# Altium schematic sheet SCH-2.SchDoc
size A4; Date: 05.05.2020; Organization: Günsel Model 1 Body Harness; Revision: v0.1
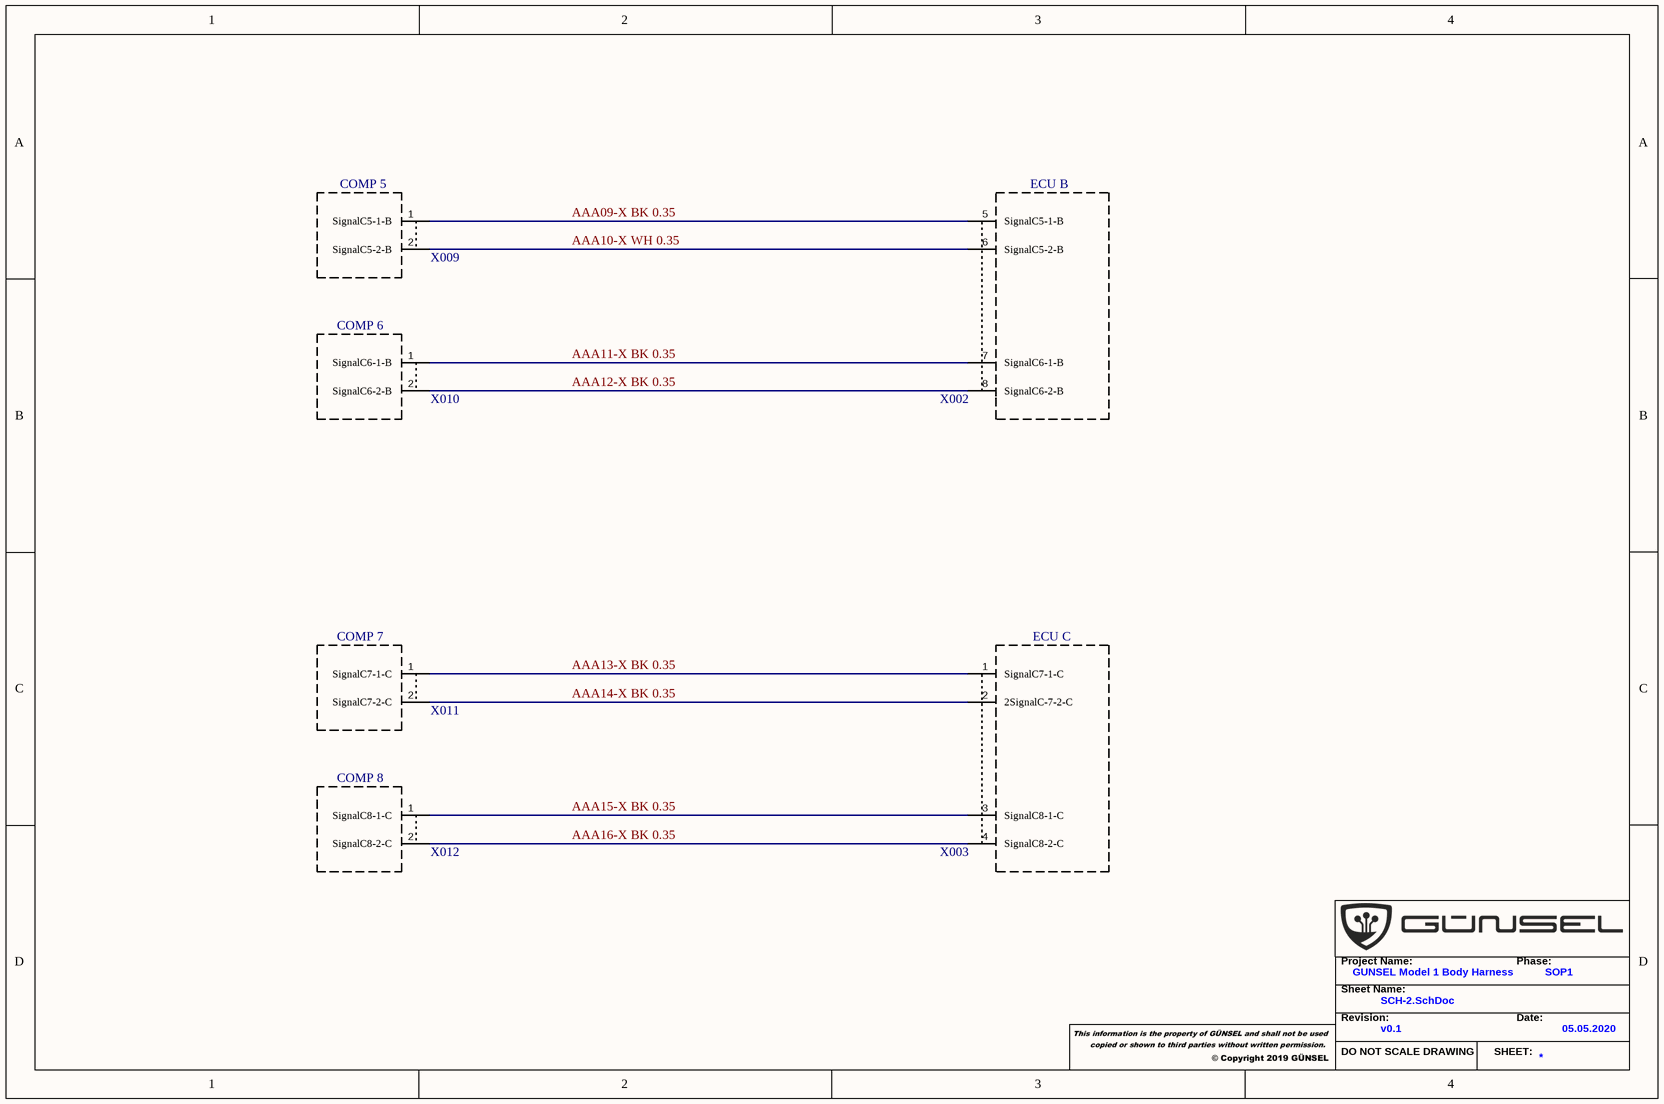
[diagram p0: SCH-2.SchDoc]

## Parts
X7  X002
X8  X009
X9  X010
X10  X003
X11  X011
X12  X012

## Blocks framed on the sheet
COMP 7: X11
ECU C: X10

## Nets
AAA09-X BK 0.35: X7.5(SignalC5-1-B) X8.1(SignalC5-1-B)
AAA10-X WH 0.35: X7.6(SignalC5-2-B) X8.2(SignalC5-2-B)
AAA11-X BK 0.35: X7.7(SignalC6-1-B) X9.1(SignalC6-1-B)
AAA12-X BK 0.35: X7.8(SignalC6-2-B) X9.2(SignalC6-2-B)
AAA13-X BK 0.35: X10.1(SignalC7-1-C) X11.1(SignalC7-1-C)
AAA14-X BK 0.35: X10.2(2SignalC-7-2-C) X11.2(SignalC7-2-C)
AAA15-X BK 0.35: X10.3(SignalC8-1-C) X12.1(SignalC8-1-C)
AAA16-X BK 0.35: X10.4(SignalC8-2-C) X12.2(SignalC8-2-C)

Not connected (* = marked no-connect by the designer): X7 1 2 3 4 9 10 11 12 13 14 15 16 17 18 19 20; X8 3 4 5; X9 3 4 5; X10 5 6 7 8 9 10 11 12 13 14 15 16 17 18 19 20; X11 3 4 5; X12 3 4 5

## Notes on the sheet
- (near X8) COMP 5
- (near X7) ECU B
- (near X9) COMP 6
- (near X12) COMP 8
- Project Name:
- GUNSEL Model 1 Body Harness
- Phase:
- SOP1
- Sheet Name:
- Revision:
- DO NOT SCALE DRAWING
- SHEET:
- Date:

## Library data of the parts
X7 = ECU B: Designator_: X002; Pin count: 20; Manufacturer Part number: E-2
X8 = COMP 5: Designator_: X009; Pin count: 5; Manufacturer Part number: C-5
X9 = COMP 6: Designator_: X010; Pin count: 5; Manufacturer Part number: C-6
X10 = ECU C: Designator_: X003; Pin count: 20; Manufacturer Part number: E-3
X11 = COMP 7: Designator_: X011; Pin count: 5; Manufacturer Part number: C-7
X12 = COMP 8: Designator_: X012; Pin count: 5; Manufacturer Part number: C-8